# Altium schematic sheet Main Schematic.SchDoc
size A3
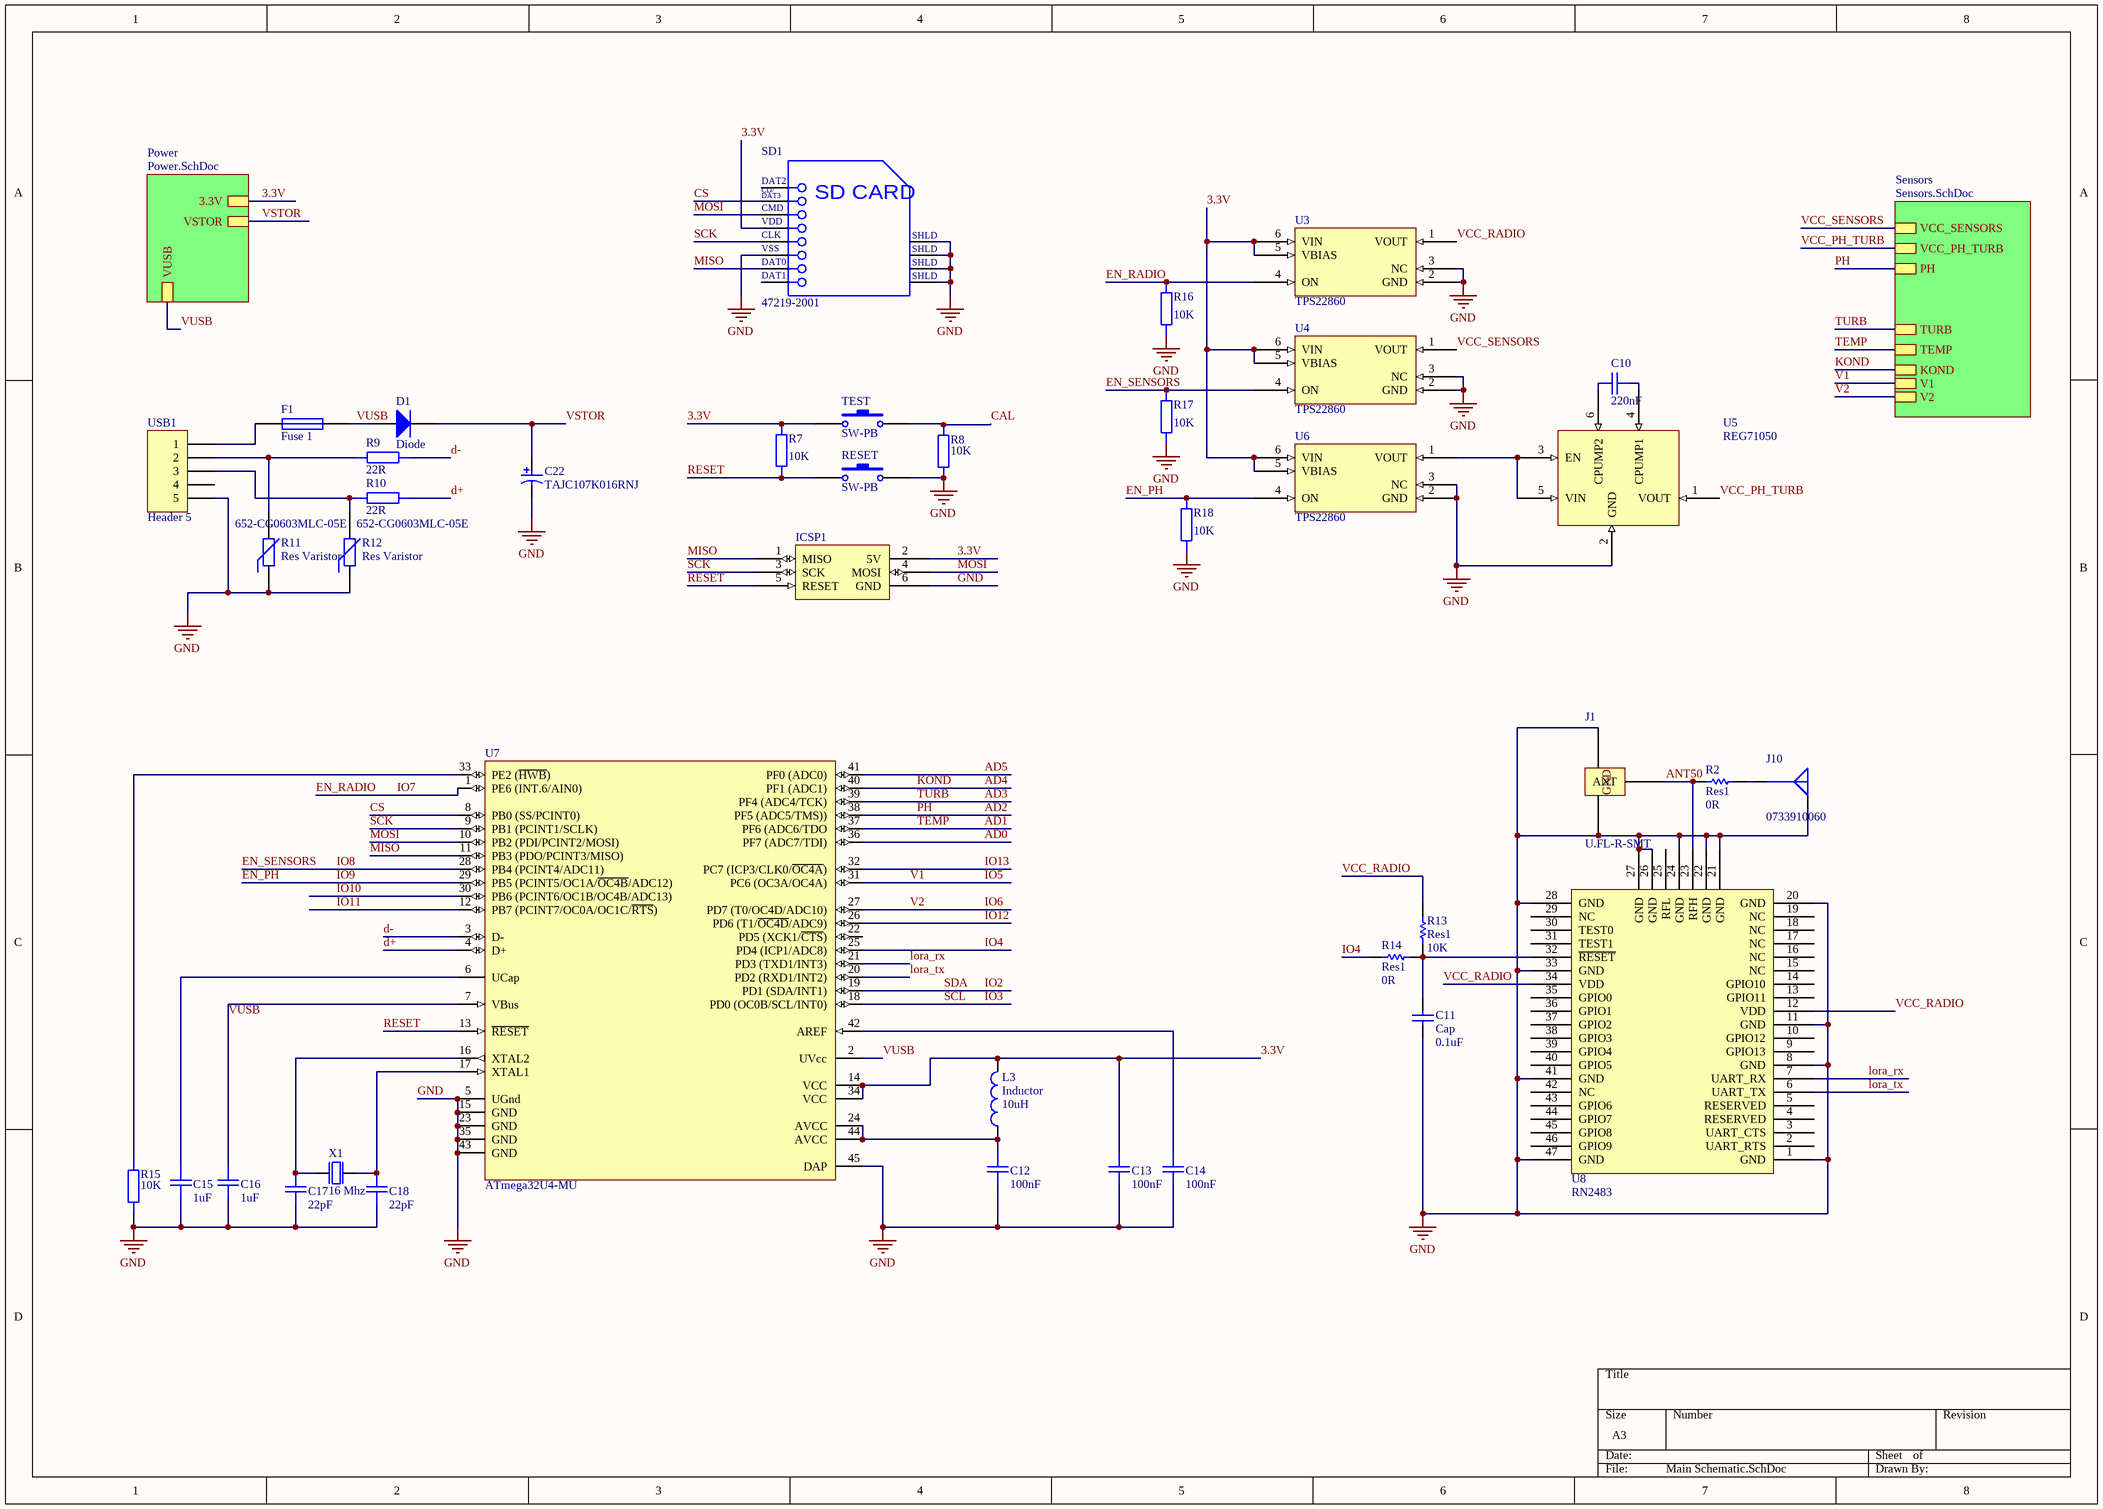
[diagram p0: Main Schematic.SchDoc]

## Parts
C10  value 220nF  [C0805]  (hidden comment: Capacitor)
C11  Cap  value 0.1uF  [C0805]
C12  value 100nF  [C0805]  (hidden comment: Capacitor)
C13  value 100nF  [C0805]  (hidden comment: Capacitor)
C14  value 100nF  [C0805]  (hidden comment: Capacitor)
C15  value 1uF  [C0805]  (hidden comment: Capacitor)
C16  value 1uF  [C0805]  (hidden comment: Capacitor)
C17  value 22pF  [C0805]  (hidden comment: Capacitor)
C18  value 22pF  [C0805]  (hidden comment: Capacitor)
C22  TAJC107K016RNJ  [AVX-TAJ-C-2_M]
D1  Diode  [3216[1206]]
F1  Fuse 1  [1812]
ICSP1  ICSP  [ICSP]  (value not drawn)
J1  U.FL-R-SMT  [U.FL-R-SMT]
J10  0733910060  [MOLEX SD-73391-0060]
L3  Inductor  value 10uH  [C0603]
R2  Res1  value 0R  [6-0805_L]
R7  value 10K  [6-0805_L]  (hidden comment: Resistor)
R8  value 10K  [6-0805_L]  (hidden comment: Resistor)
R9  value 22R  [6-0805_L]  (hidden comment: Resistor)
R10  value 22R  [6-0805_L]  (hidden comment: Resistor)
R11  Res Varistor  Supplier Part Number 1: 652-CG0603MLC-05E  [6-0805_L]
R12  Res Varistor  Supplier Part Number 1: 652-CG0603MLC-05E  [6-0805_L]
R13  Res1  value 10K  [6-0805_L]
R14  Res1  value 0R  [6-0805_L]
R15  value 10K  [6-0805_L]  (hidden comment: Resistor)
R16  value 10K  [6-0805_L]  (hidden comment: Resistor)
R17  value 10K  [6-0805_L]  (hidden comment: Resistor)
R18  value 10K  [6-0805_L]  (hidden comment: Resistor)
RESET  SW-PB  [BUTTON]
SD1  47219-2001  [MOLX-47219-2001-8_V]
TEST  SW-PB  [BUTTON]
U3  TPS22860  [DBV PSOP]
U4  TPS22860  [DBV PSOP]
U5  REG71050  [DBV PSOP]
U6  TPS22860  [DBV PSOP]
U7  ATmega32U4-MU  [TQFP44]
U8  RN2483  [RN2483 - duplicate]
USB1  Header 5  [10118193-0001LF]
X1  16 Mhz  [XTAL CSM-3X]

## Sub-sheets
Power = Power.SchDoc: 3.3V, VUSB, VSTOR
Sensors = Sensors.SchDoc: KOND, PH, VCC_SENSORS, V2, V1, TURB, TEMP, VCC_PH_TURB

## Nets
GND: C11.2 C12.2 C13.2 C14.2 C15.2 C16.2 C17.2 C18.2 C22.2 ICSP1.6(GND) J1.2(GND) J1.3(GND) J10.G R8.2 R11.1 R12.1 R15.2 R16.2 R17.2 R18.2 RESET.2 SD1.6(VSS) SD1.9(SHLD) SD1.10(SHLD) SD1.11(SHLD) SD1.12(SHLD) U3.2(GND) U3.3(NC) U4.2(GND) U4.3(NC) U5.2(GND) U6.2(GND) U6.3(NC) U7.5(UGnd) U7.15(GND) U7.23(GND) U7.35(GND) U7.43(GND) U7.45(DAP) U8.1(GND) U8.8(GND) U8.11(GND) U8.20(GND) U8.21(GND) U8.22(GND) U8.24(GND) U8.26(GND) U8.27(GND) U8.28(GND) U8.33(GND) U8.41(GND) U8.47(GND) USB1.5
3.3V: C13.1 ICSP1.2(5V) L3.1 R7.1 SD1.4(VDD) TEST.1 U3.5(VBIAS) U3.6(VIN) U4.5(VBIAS) U4.6(VIN) U6.5(VBIAS) U6.6(VIN) U7.14(VCC) U7.34(VCC) ; sheet Power/3.3V
AD0: U7.36(PF7_(ADC7/TDI))
AD1: U7.37(PF6_(ADC6/TDO) ; sheet Sensors/TEMP  [also labelled TEMP]
AD2: U7.38(PF5_(ADC5/TMS))) ; sheet Sensors/PH  [also labelled PH]
AD3: U7.39(PF4_(ADC4/TCK)) ; sheet Sensors/TURB  [also labelled TURB]
AD4: U7.40(PF1_(ADC1)) ; sheet Sensors/KOND  [also labelled KOND]
AD5: U7.41(PF0_(ADC0))
ANT50: J1.1(ANT) R2.1 U8.23(RFH)
CAL: R8.1 TEST.2
CS: SD1.2(CD/DAT3) U7.8(PB0_(SS/PCINT0))
d+: R10.2 U7.4(D+)
d-: R9.2 U7.3(D-)
EN_PH: R18.1 U6.4(ON) U7.29(PB5_(PCINT5/OC1A/~{OC4B}/ADC12))  [also labelled IO9]
EN_RADIO: R16.1 U3.4(ON) U7.1(PE6_(INT.6/AIN0))  [also labelled IO7]
EN_SENSORS: R17.1 U4.4(ON) U7.28(PB4_(PCINT4/ADC11))  [also labelled IO8]
IO2: U7.19(PD1_(SDA/INT1))  [also labelled SDA]
IO3: U7.18(PD0_(OC0B/SCL/INT0))  [also labelled SCL]
IO4: R14.1 U7.25(PD4_(ICP1/ADC8))
IO5: U7.31(PC6_(OC3A/OC4A)) ; sheet Sensors/V1  [also labelled V1]
IO6: U7.27(PD7_(T0/OC4D/ADC10)) ; sheet Sensors/V2  [also labelled V2]
IO10: U7.30(PB6_(PCINT6/OC1B/OC4B/ADC13))
IO11: U7.12(PB7_(PCINT7/OC0A/OC1C/~{RTS}))
IO12: U7.26(PD6_(T1/~{OC4D}/ADC9))
IO13: U7.32(PC7_(ICP3/CLK0/~{OC4A}))
lora_rx: U7.21(PD3_(TXD1/INT3)) U8.7(UART_RX)
lora_tx: U7.20(PD2_(RXD1/INT2)) U8.6(UART_TX)
MISO: ICSP1.1(MISO) SD1.7(DAT0) U7.11(PB3_(PDO/PCINT3/MISO))
MOSI: ICSP1.4(MOSI) SD1.3(CMD) U7.10(PB2_(PDI/PCINT2/MOSI))
RESET: ICSP1.5(RESET) R7.2 RESET.1 U7.13(~{RESET})
SCK: ICSP1.3(SCK) SD1.5(CLK) U7.9(PB1_(PCINT1/SCLK))
VCC_PH_TURB: U5.1(VOUT) ; sheet Sensors/VCC_PH_TURB
VCC_RADIO: R13.1 U3.1(VOUT) U8.12(VDD) U8.34(VDD)
VCC_SENSORS: U4.1(VOUT) ; sheet Sensors/VCC_SENSORS
VSTOR: C22.1 D1.2(K) ; sheet Power/VSTOR
VUSB: C16.1 D1.1(A) F1.2 U7.2(UVcc) U7.7(VBus) ; sheet Power/VUSB
NetC10_1: C10.1 U5.6(CPUMP2)
NetC10_2: C10.2 U5.4(CPUMP1)
NetC11_1: C11.1 R13.2 R14.2 U8.32(~{RESET})
NetC12_1: C12.1 L3.2 U7.24(AVCC) U7.44(AVCC)
NetC14_1: C14.1 U7.42(AREF)
NetC15_1: C15.1 U7.6(UCap)
NetC17_1: C17.1 U7.16(XTAL2) X1.1(inp)
NetC18_1: C18.1 U7.17(XTAL1) X1.2(out)
NetF1_1: F1.1 USB1.1
NetJ10_S: J10.S R2.2
NetR9_1: R9.1 R11.2 USB1.2
NetR10_1: R10.1 R12.2 USB1.3
NetR15_1: R15.1 U7.33(PE2_(~{HWB}))
NetU5_3: U5.3(EN) U5.5(VIN) U6.1(VOUT)

Not connected (* = marked no-connect by the designer): SD1 1(DAT2) 8(DAT1); U7 22(PD5_(XCK1/~{CTS})); U8 2(UART_RTS) 3(UART_CTS) 4(RESERVED) 5(RESERVED) 9(GPIO13) 10(GPIO12) 13(GPIO11) 14(GPIO10) 15(NC) 16(NC) 17(NC) 18(NC) 19(NC) 25(RFL) 29(NC) 30(TEST0) 31(TEST1) 35(GPIO0) 36(GPIO1) 37(GPIO2) 38(GPIO3) 39(GPIO4) 40(GPIO5) 42(NC) 43(GPIO6) 44(GPIO7) 45(GPIO8) 46(GPIO9); USB1 4

## Notes on the sheet
- (in symbol CMP-2000-05245-1) CD/; DAT3; SD CARD

## Library data of the parts
C10 C12-C18 = Capacitor: Voltage: 16V; Tolerance: 10%; Package: 0603
C11 = Cap: Capacitor; Published: 8-Jun-2000; LatestRevisionDate: 17-Jul-2002; LatestRevisionNote: Re-released for DXP Platform.; PackageReference: RAD-0.3; Publisher: Altium Limited; PackageDescription: Radial Cap, Thru-Hole; 2 Leads; 0.3 in Pin Spacing
C22 = CMP-2100-03691-1: Standard Tantalum, 100 uF, +/- 10%, 16 V, -55 to 125 degC, 2-Pin SMD (2312), RoHS, Tape and Reel; Manufacturer: AVX; Resistance: 1Ohm; Dissipation Factor: 8%; Voltage Rating: 16V; Polarity: Polar; Capacitance: 100uF; Leakage Current: 16uA; Datasheet URL: http://datasheets.avx.com/TAJ.pdf; Package Description: 2-Pin Surface Mount Device, Body 6 x 3.25 mm; Case/Package: Molded; Case Code (Metric): 6032; Number of Pins: 2; Tolerance: 10%; Length: 6mm; Width: 3.2mm; Height: 2.8mm; Height - Seated (Max): 0.11inch; Min Operating Temperature: -55degC; Termination: SMD/SMT; Voltage Rating (DC): 16V; Max Operating Temperature: 125degC; Package Quantity: 1; Manufacturer URL: http://www.avx.com/; RoHSCompliant: True; ESR (Equivalent Series Resistance): 1Ohm; Packaging: TapeandReel; Radiation Hardening: No; Lead Free: LeadFree; Case Code (Imperial): 2412; Depth: 3.2mm; Datasheet Version: 42401.0; Package Reference: TAJ-C-2; REACH SVHC: NoSVHC
D1 = Diode: Default Diode; Published: 8-Jun-2000; LatestRevisionDate: 17-Jul-2002; LatestRevisionNote: Re-released for DXP Platform.; PackageVersion: Sep-1996; PackageReference: SMC; Publisher: Altium Limited; PackageDescription: DO-214-AB/SMC; 2 C-Bend Leads; Body 7.9 x 5.9 mm, inc. leads (LxW); Code_JEDEC: DO-214-AB
F1 = Fuse 1: Fuse; Published: 8-Jun-2000; LatestRevisionDate: 17-Jul-2002; LatestRevisionNote: Re-released for DXP Platform.; PackageReference: PIN-W2/E2.8; Publisher: Altium Limited; PackageDescription: Thru-Hole; 2 Leads
J10 = 0733910060: CONN SMA JACK STR 50 OHM PCB; Part Number: 0733910060
L3 = Inductor: Code_IEC: 1005; Published: 8-Jun-2000; LatestRevisionDate: 29-May-2009; LatestRevisionNote: IPC-7351 Footprint Added.; PackageReference: 0402-A; Publisher: Altium Limited; PackageDescription: Chip Inductor; Code_JEITA: 0402
R2 R13 R14 = Res1: Resistor; Published: 8-Jun-2000; LatestRevisionDate: 17-Jul-2002; LatestRevisionNote: Re-released for DXP Platform.; PackageReference: AXIAL-0.3; Publisher: Altium Limited; PackageDescription: Axial Device, Thru-Hole; 2 Leads; 0.3 in Pin Spacing
R7-R10 R15-R18 = Resistor: Tolerance: 1%; Power Rating: 1/4W; Package: 0602
R11 R12 = Res Varistor: Varistor (Voltage-Sensitive Resistor); Manufacturer: Bourns; Manufacturer Part Number: CG0603MLC-05E; Capacitance: 0.5pF; Voltage Rating (DC): 5V; Voltage Rating (AC): 8V; Number of Channels: 1; Clamping Voltage: 20V; Current Rating: 50nA; Turn-On Delay Time: 1ns; Element Configuration: Single; Published: 24-Mar-1999; LatestRevisionDate: 29-May-2009; LatestRevisionNote: IPC-7351 Footprint Added.; PackageVersion: Mar-2003; PackageReference: 6-0805; Publisher: Altium Limited; PackageDescription: Chip Resistor 0805 Case Size; Code_IPC: RESC2012; Supplier 1: Mouser; Stock 1: 88623; Pricing 1: 1=0.51, 10=0.294, 50=0.294, 100=0.171, 1000=0.107, 10000=0.08 (USD); Case/Package: 0603; Number of Pins: 2; Case Code (Imperial): 0603; Case Code (Metric): 1608; Contact Plating: Tin; Min Operating Temperature: -40°C; Max Operating Temperature: 85°C; Operating Supply Voltage: 5V; Package Quantity: 1; Packaging: Tape and Reel; Termination: SMD/SMT; Voltage: 5V; Number of Circuits: 1; Max Voltage Rating (DC): 5V; Working Voltage: 5V; Leakage Current: 50nA; Length: 1.6mm; Width: 0.8mm; Depth: 0.8mm; Thickness: 0.8mm; Radiation Hardening: No; REACH SVHC: No SVHC; ComponentLink1URL: https://www.bourns.com/docs/Product-Datasheets/MLC.pdf; ComponentLink1Description: https://www.bourns.com/docs/Product-Datasheets/MLC.pdf; ComponentLink2URL: http://www.farnell.com/datasheets/1785244.pdf; ComponentLink2Description: http://www.farnell.com/datasheets/1785244.pdf; ComponentLink3URL: http://www.jameco.com/Jameco/Products/ProdDS/1163231.pdf; ComponentLink3Description: http://www.jameco.com/Jameco/Products/ProdDS/1163231.pdf; ComponentLink4URL: http://www.bourns.com/docs/Product-Datasheets/MLC.pdf; ComponentLink4Description: http://www.bourns.com/docs/Product-Datasheets/MLC.pdf
RESET TEST = SW-PB: Switch; Published: 24-Mar-1999; LatestRevisionDate: 17-Jul-2002; LatestRevisionNote: Re-released for DXP Platform.; PackageReference: SPST-2; Publisher: Altium Limited; PackageDescription: Switch; 2 Leads
SD1 = CMP-2000-05245-1: MicroSD Card Connector, Hinge Type, -40 to 85 degC, 8-Pin SMD, RoHS, Tape and Reel; Manufacturer: Molex; Current Rating: 500mA; Number of Contacts: 8; Pitch: 1.09mm; Insertion - Extraction Style: Hinged; Voltage Rating: 100VDC; Product: CardConnectors; Contact Material: CopperAlloy; Series: 47219; Packaging: Reel; Brand: Molex; Product Category: MemoryCardConnectors; Housing Material: Thermoplastic; Mounting Style: SMD/SMT; Termination Style: SMD; Datasheet Version: Rev. F, 06/2009; Card Type: microSD; Manufacturer URL: http://www.molex.com/; RoHS: Details; Datasheet URL: http://www.molex.com/pdm_docs/sd/472192001_sd.pdf; Factory Pack Quantity: 2400
U3 U4 U6 = TPS22860: Load switch; ComponentLink1Description: datasheet; ComponentLink1URL: http://www.ti.com/lit/ds/symlink/tps22860.pdf
U5 = REG71050: Reguator 5V
U7 = ATmega32U4-MU: 8-bit AVR Microcontroller, 2.7-5.5V, 32KB Flash, 2.5KB EEPROM, 1KB SRAM, USB Controller, 44-pin QFN, Industrial Grade (-40°C to 85°C); pin to pad: 45>43; Published: 1-Apr-2010; DatasheetVersion: revD, Jan-2009; PackageVersion: revF, Jul-2007; PackageReference: 44PW; Publisher: Altium Limited; PackageDescription: 44-Pin Quad Flat No-Lead Package, 7 x 7 mm Body, 0.5 mm Pitch (QFN); Supplier 1: Digi-Key; Supplier Part Number 1: ATMEGA32U4-MU-ND; Supplier 2: Mouser; Supplier Part Number 2: 556-ATMEGA32U4-MU; Code_JEDEC: MO-220-VKKD-1; ComponentLink1Description: Manufacturer Link; ComponentLink1URL: http://www.atmel.com/products/avr/default.asp?; ComponentLink2Description: ATmega16U4/32U4 Datasheet; ComponentLink2URL: http://www.atmel.com/dyn/resources/prod_documents/doc7766.pdf; ComponentLink3Description: ATmega16U4 ATmega32U4 Summary; ComponentLink3URL: http://www.atmel.com/dyn/resources/prod_documents/7766S.pdf; ComponentLink4Description: Atmel.com Home; ComponentLink4URL: http://www.atmel.com
USB1 = Header 5: Header, 5-Pin; LatestRevisionDate: 17-Jul-2002; LatestRevisionNote: Re-released for DXP Platform.; Publisher: Altium Limited
X1 = NX2520SA-16MHZ-STD-CSW-5: XTAL SMD 2520, 16MHz, 8pF, ±15ppm; Manufacturer: NDK; Value: 8MHz; Note: XTAL SMD 16.000MHz; Artikkelnr Noca: 22019192; Artikkelnr Simpro: N.A.; Part Number: NX2520SA-16MHZ-STD-CSW-5; Manufacturer Part Number: NX2520SA-16MHZ-STD-CSW-5; Datasheet: http://www.ndk.com/images/products/catalog/c_NX2520SA-STD-CSW-5_e.pdf; LatestRevisionDate: 2012-06-15; Pin Count: 4; Publisher: Nordic Semiconductor; Published: 2012-06-15; Supplier: Digi-Key; Supplier part number: 644-1169-1-ND; 2nd source Supplier: *; 2nd source part number: *; Footprint Doc: BT-XTAL_2520